# Altium schematic sheet fpga11-serdes-power.SchDoc
size Tabloid; SheetNumber: 46; SheetTotal: 71
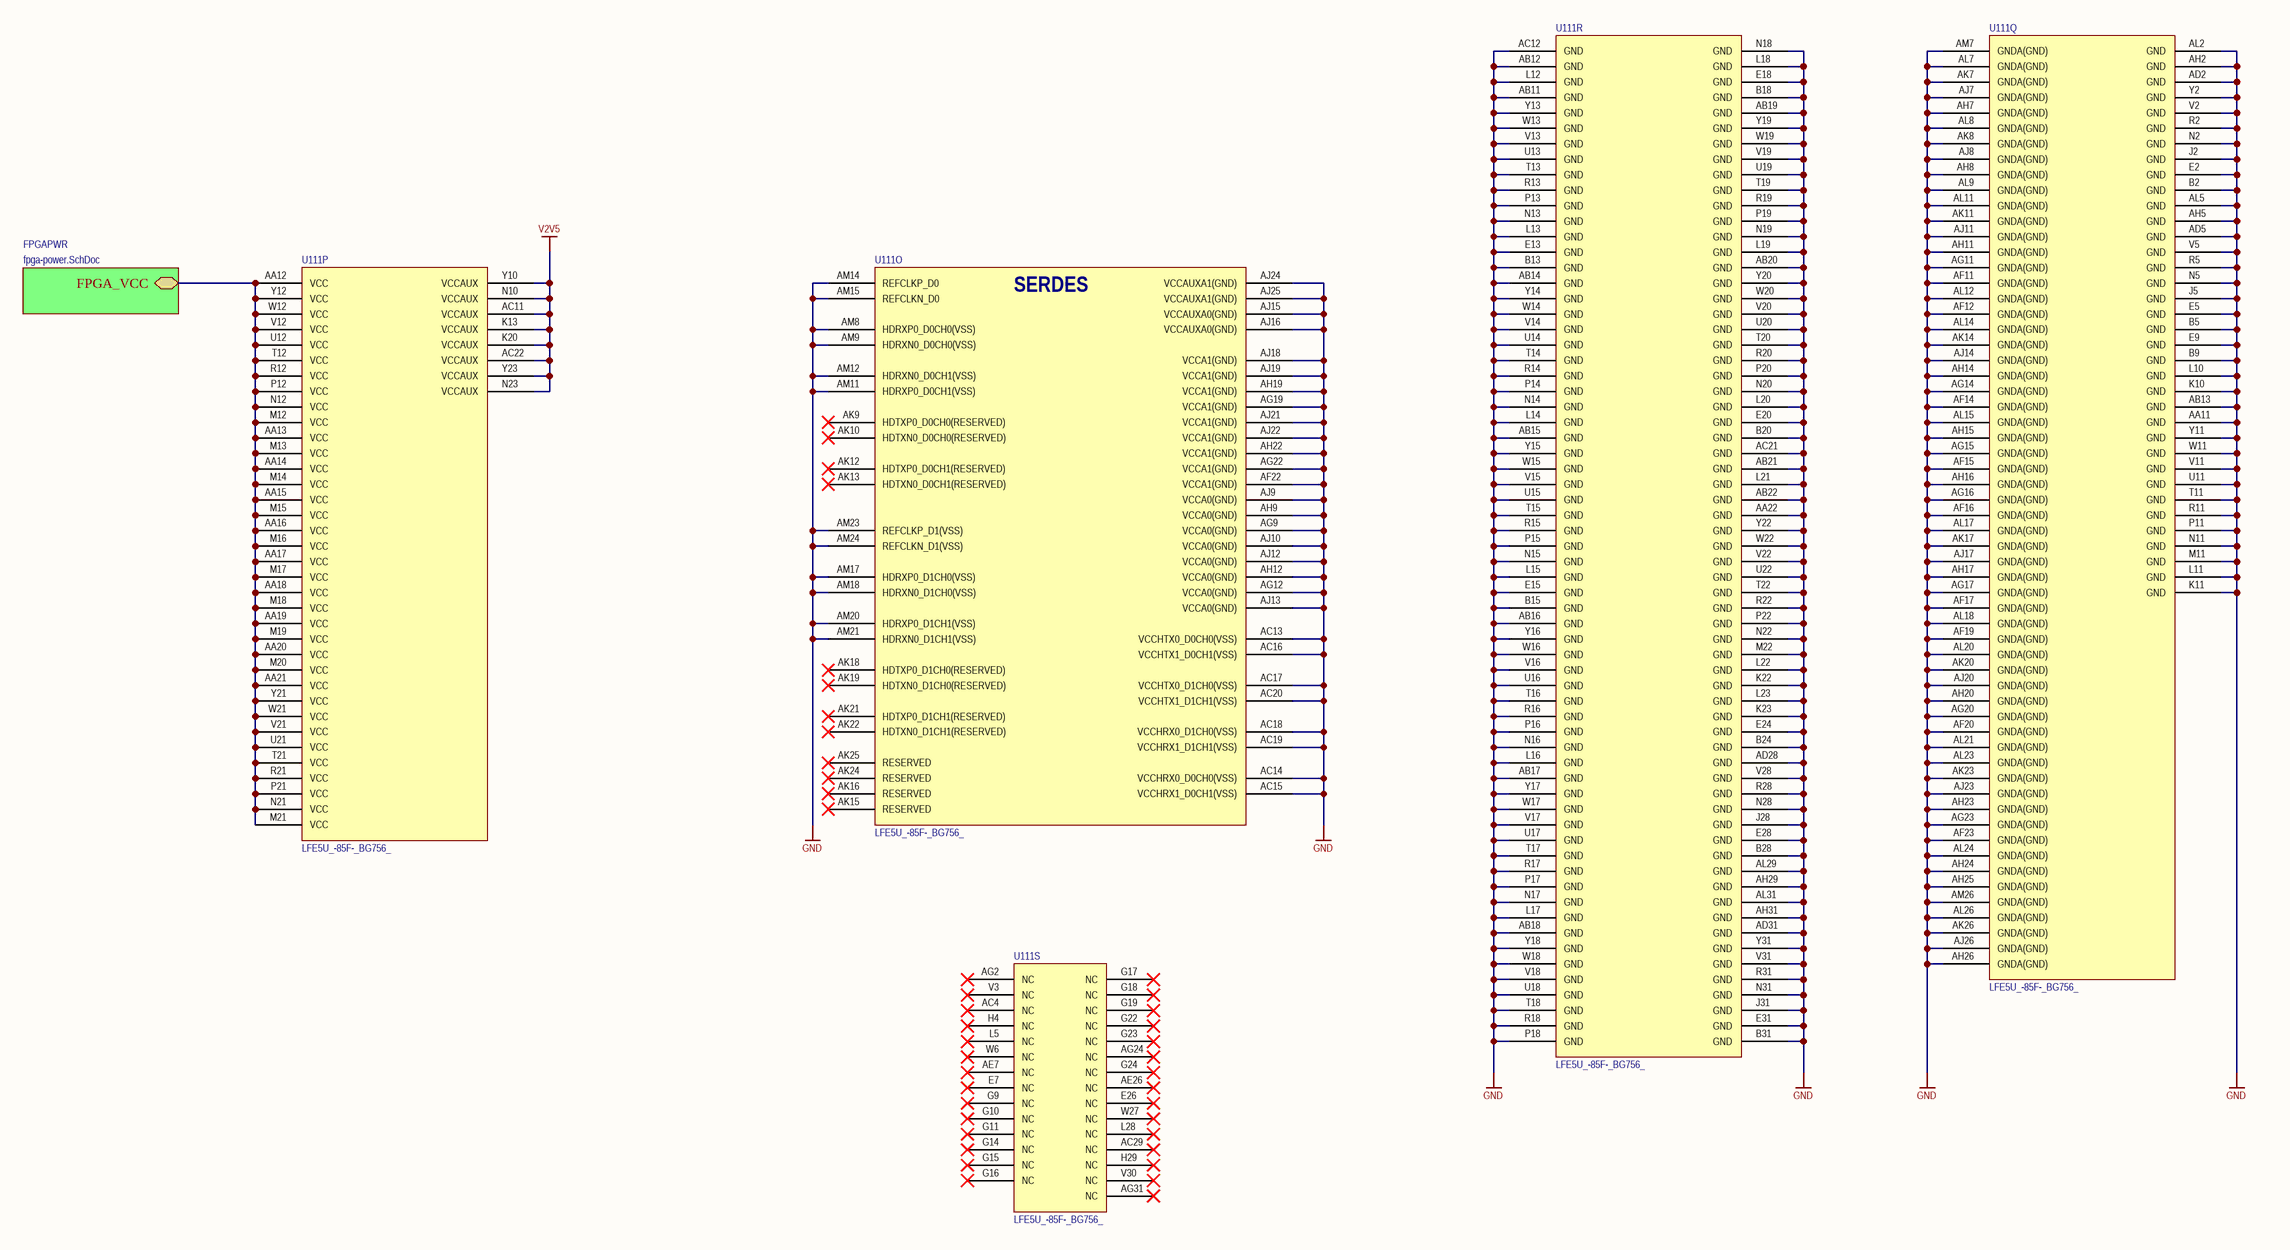
[diagram p0: fpga11-serdes-power.SchDoc]

## Parts
U111  LFE5U_-85F-_BG756_  [caBGA756]  (parts O,P,Q,R,S of 19)

## Sub-sheets
FPGAPWR = fpga-power.SchDoc: FPGA_VCC

## Nets
GND: U111.AA11(GND) U111.AA22(GND) U111.AB11(GND) U111.AB12(GND) U111.AB13(GND) U111.AB14(GND) U111.AB15(GND) U111.AB16(GND) U111.AB17(GND) U111.AB18(GND) U111.AB19(GND) U111.AB20(GND) U111.AB21(GND) U111.AB22(GND) U111.AC12(GND) U111.AC13(VCCHTX0_D0CH0(VSS)) U111.AC14(VCCHRX0_D0CH0(VSS)) U111.AC15(VCCHRX1_D0CH1(VSS)) U111.AC16(VCCHTX1_D0CH1(VSS)) U111.AC17(VCCHTX0_D1CH0(VSS)) U111.AC18(VCCHRX0_D1CH0(VSS)) U111.AC19(VCCHRX1_D1CH1(VSS)) U111.AC20(VCCHTX1_D1CH1(VSS)) U111.AC21(GND) U111.AD2(GND) U111.AD5(GND) U111.AD28(GND) U111.AD31(GND) U111.AF11(GNDA(GND)) U111.AF12(GNDA(GND)) U111.AF14(GNDA(GND)) U111.AF15(GNDA(GND)) U111.AF16(GNDA(GND)) U111.AF17(GNDA(GND)) U111.AF19(GNDA(GND)) U111.AF20(GNDA(GND)) U111.AF22(VCCA1(GND)) U111.AF23(GNDA(GND)) U111.AG9(VCCA0(GND)) U111.AG11(GNDA(GND)) U111.AG12(VCCA0(GND)) U111.AG14(GNDA(GND)) U111.AG15(GNDA(GND)) U111.AG16(GNDA(GND)) U111.AG17(GNDA(GND)) U111.AG19(VCCA1(GND)) U111.AG20(GNDA(GND)) U111.AG22(VCCA1(GND)) U111.AG23(GNDA(GND)) U111.AH2(GND) U111.AH5(GND) U111.AH7(GNDA(GND)) U111.AH8(GNDA(GND)) U111.AH9(VCCA0(GND)) U111.AH11(GNDA(GND)) U111.AH12(VCCA0(GND)) U111.AH14(GNDA(GND)) U111.AH15(GNDA(GND)) U111.AH16(GNDA(GND)) U111.AH17(GNDA(GND)) U111.AH19(VCCA1(GND)) U111.AH20(GNDA(GND)) U111.AH22(VCCA1(GND)) U111.AH23(GNDA(GND)) U111.AH24(GNDA(GND)) U111.AH25(GNDA(GND)) U111.AH26(GNDA(GND)) U111.AH29(GND) U111.AH31(GND) U111.AJ7(GNDA(GND)) U111.AJ8(GNDA(GND)) U111.AJ9(VCCA0(GND)) U111.AJ10(VCCA0(GND)) U111.AJ11(GNDA(GND)) U111.AJ12(VCCA0(GND)) U111.AJ13(VCCA0(GND)) U111.AJ14(GNDA(GND)) U111.AJ15(VCCAUXA0(GND)) U111.AJ16(VCCAUXA0(GND)) U111.AJ17(GNDA(GND)) U111.AJ18(VCCA1(GND)) U111.AJ19(VCCA1(GND)) U111.AJ20(GNDA(GND)) U111.AJ21(VCCA1(GND)) U111.AJ22(VCCA1(GND)) U111.AJ23(GNDA(GND)) U111.AJ24(VCCAUXA1(GND)) U111.AJ25(VCCAUXA1(GND)) U111.AJ26(GNDA(GND)) U111.AK7(GNDA(GND)) U111.AK8(GNDA(GND)) U111.AK11(GNDA(GND)) U111.AK14(GNDA(GND)) U111.AK17(GNDA(GND)) U111.AK20(GNDA(GND)) U111.AK23(GNDA(GND)) U111.AK26(GNDA(GND)) U111.AL2(GND) U111.AL5(GND) U111.AL7(GNDA(GND)) U111.AL8(GNDA(GND)) U111.AL9(GNDA(GND)) U111.AL11(GNDA(GND)) U111.AL12(GNDA(GND)) U111.AL14(GNDA(GND)) U111.AL15(GNDA(GND)) U111.AL17(GNDA(GND)) U111.AL18(GNDA(GND)) U111.AL20(GNDA(GND)) U111.AL21(GNDA(GND)) U111.AL23(GNDA(GND)) U111.AL24(GNDA(GND)) U111.AL26(GNDA(GND)) U111.AL29(GND) U111.AL31(GND) U111.AM7(GNDA(GND)) U111.AM8(HDRXP0_D0CH0(VSS)) U111.AM9(HDRXN0_D0CH0(VSS)) U111.AM11(HDRXP0_D0CH1(VSS)) U111.AM12(HDRXN0_D0CH1(VSS)) U111.AM14(REFCLKP_D0) U111.AM15(REFCLKN_D0) U111.AM17(HDRXP0_D1CH0(VSS)) U111.AM18(HDRXN0_D1CH0(VSS)) U111.AM20(HDRXP0_D1CH1(VSS)) U111.AM21(HDRXN0_D1CH1(VSS)) U111.AM23(REFCLKP_D1(VSS)) U111.AM24(REFCLKN_D1(VSS)) U111.AM26(GNDA(GND)) U111.B2(GND) U111.B5(GND) U111.B9(GND) U111.B13(GND) U111.B15(GND) U111.B18(GND) U111.B20(GND) U111.B24(GND) U111.B28(GND) U111.B31(GND) U111.E2(GND) U111.E5(GND) U111.E9(GND) U111.E13(GND) U111.E15(GND) U111.E18(GND) U111.E20(GND) U111.E24(GND) U111.E28(GND) U111.E31(GND) U111.J2(GND) U111.J5(GND) U111.J28(GND) U111.J31(GND) U111.K10(GND) U111.K11(GND) U111.K22(GND) U111.K23(GND) U111.L10(GND) U111.L11(GND) U111.L12(GND) U111.L13(GND) U111.L14(GND) U111.L15(GND) U111.L16(GND) U111.L17(GND) U111.L18(GND) U111.L19(GND) U111.L20(GND) U111.L21(GND) U111.L22(GND) U111.L23(GND) U111.M11(GND) U111.M22(GND) U111.N2(GND) U111.N5(GND) U111.N11(GND) U111.N13(GND) U111.N14(GND) U111.N15(GND) U111.N16(GND) U111.N17(GND) U111.N18(GND) U111.N19(GND) U111.N20(GND) U111.N22(GND) U111.N28(GND) U111.N31(GND) U111.P11(GND) U111.P13(GND) U111.P14(GND) U111.P15(GND) U111.P16(GND) U111.P17(GND) U111.P18(GND) U111.P19(GND) U111.P20(GND) U111.P22(GND) U111.R2(GND) U111.R5(GND) U111.R11(GND) U111.R13(GND) U111.R14(GND) U111.R15(GND) U111.R16(GND) U111.R17(GND) U111.R18(GND) U111.R19(GND) U111.R20(GND) U111.R22(GND) U111.R28(GND) U111.R31(GND) U111.T11(GND) U111.T13(GND) U111.T14(GND) U111.T15(GND) U111.T16(GND) U111.T17(GND) U111.T18(GND) U111.T19(GND) U111.T20(GND) U111.T22(GND) U111.U11(GND) U111.U13(GND) U111.U14(GND) U111.U15(GND) U111.U16(GND) U111.U17(GND) U111.U18(GND) U111.U19(GND) U111.U20(GND) U111.U22(GND) U111.V2(GND) U111.V5(GND) U111.V11(GND) U111.V13(GND) U111.V14(GND) U111.V15(GND) U111.V16(GND) U111.V17(GND) U111.V18(GND) U111.V19(GND) U111.V20(GND) U111.V22(GND) U111.V28(GND) U111.V31(GND) U111.W11(GND) U111.W13(GND) U111.W14(GND) U111.W15(GND) U111.W16(GND) U111.W17(GND) U111.W18(GND) U111.W19(GND) U111.W20(GND) U111.W22(GND) U111.Y2(GND) U111.Y11(GND) U111.Y13(GND) U111.Y14(GND) U111.Y15(GND) U111.Y16(GND) U111.Y17(GND) U111.Y18(GND) U111.Y19(GND) U111.Y20(GND) U111.Y22(GND) U111.Y31(GND)
V2V5: U111.AC11(VCCAUX) U111.AC22(VCCAUX) U111.K13(VCCAUX) U111.K20(VCCAUX) U111.N10(VCCAUX) U111.N23(VCCAUX) U111.Y10(VCCAUX) U111.Y23(VCCAUX)
NetU111_AA12: U111.AA12(VCC) U111.AA13(VCC) U111.AA14(VCC) U111.AA15(VCC) U111.AA16(VCC) U111.AA17(VCC) U111.AA18(VCC) U111.AA19(VCC) U111.AA20(VCC) U111.AA21(VCC) U111.M12(VCC) U111.M13(VCC) U111.M14(VCC) U111.M15(VCC) U111.M16(VCC) U111.M17(VCC) U111.M18(VCC) U111.M19(VCC) U111.M20(VCC) U111.M21(VCC) U111.N12(VCC) U111.N21(VCC) U111.P12(VCC) U111.P21(VCC) U111.R12(VCC) U111.R21(VCC) U111.T12(VCC) U111.T21(VCC) U111.U12(VCC) U111.U21(VCC) U111.V12(VCC) U111.V21(VCC) U111.W12(VCC) U111.W21(VCC) U111.Y12(VCC) U111.Y21(VCC) ; sheet FPGAPWR/FPGA_VCC

Not connected (* = marked no-connect by the designer): U111 AC4(NC)* AC29(NC)* AE7(NC)* AE26(NC)* AG2(NC)* AG24(NC)* AG31(NC)* AK9(HDTXP0_D0CH0(RESERVED))* AK10(HDTXN0_D0CH0(RESERVED))* AK12(HDTXP0_D0CH1(RESERVED))* AK13(HDTXN0_D0CH1(RESERVED))* AK15(RESERVED)* AK16(RESERVED)* AK18(HDTXP0_D1CH0(RESERVED))* AK19(HDTXN0_D1CH0(RESERVED))* AK21(HDTXP0_D1CH1(RESERVED))* AK22(HDTXN0_D1CH1(RESERVED))* AK24(RESERVED)* AK25(RESERVED)* E7(NC)* E26(NC)* G9(NC)* G10(NC)* G11(NC)* G14(NC)* G15(NC)* G16(NC)* G17(NC)* G18(NC)* G19(NC)* G22(NC)* G23(NC)* G24(NC)* H4(NC)* H29(NC)* L5(NC)* L28(NC)* V3(NC)* V30(NC)* W6(NC)* W27(NC)*

## Notes on the sheet
- (in symbol LFE5U_-85F-_BG756_, part O) SERDES

## Library data of the parts
U111 = LFE5U_-85F-_BG756_: ECP5 FPGA, 85k LUT, 756-caBGA; Manufacturer: Lattice Semiconductor; Manufacturer P/N: LFE5U_-85F-_BG756_